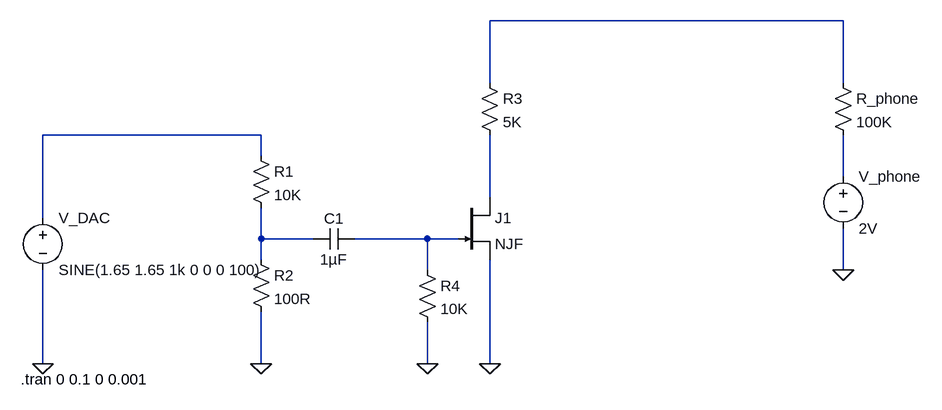
[diagram p0: schematic Mic_interface.asc]
Mic_interface.asc, the LTspice schematic file:
Version 4
SHEET 1 1432 680
WIRE 1280 -304 736 -304
WIRE 736 -208 736 -304
WIRE 1280 -208 1280 -304
WIRE 384 -128 48 -128
WIRE 384 -96 384 -128
WIRE 1280 -64 1280 -128
WIRE 736 -32 736 -128
WIRE 48 0 48 -128
WIRE 384 32 384 -16
WIRE 464 32 384 32
WIRE 640 32 528 32
WIRE 688 32 640 32
WIRE 384 64 384 32
WIRE 640 80 640 32
WIRE 1280 80 1280 16
WIRE 48 224 48 80
WIRE 384 224 384 144
WIRE 640 224 640 160
WIRE 736 224 736 64
FLAG 48 224 0
FLAG 384 224 0
FLAG 640 224 0
FLAG 1280 80 0
FLAG 736 224 0
SYMBOL voltage 48 -16 R0
WINDOW 123 0 0 Left 0
WINDOW 39 0 0 Left 0
SYMATTR InstName V_DAC
SYMATTR Value SINE(1.65 1.65 1k 0 0 0 100)
SYMBOL res 368 -112 R0
SYMATTR InstName R1
SYMATTR Value 10K
SYMBOL res 368 48 R0
SYMATTR InstName R2
SYMATTR Value 100R
SYMBOL res 720 -224 R0
SYMATTR InstName R3
SYMATTR Value 5K
SYMBOL res 624 64 R0
SYMATTR InstName R4
SYMATTR Value 10K
SYMBOL res 1264 -224 R0
SYMATTR InstName R_phone
SYMATTR Value 100K
SYMBOL cap 528 16 R90
WINDOW 0 0 32 VBottom 2
WINDOW 3 32 32 VTop 2
SYMATTR InstName C1
SYMATTR Value 1µF
SYMBOL njf 688 -32 R0
SYMATTR InstName J1
SYMBOL voltage 1280 -80 R0
SYMATTR InstName V_phone
SYMATTR Value 2V
TEXT 14 248 Left 2 !.tran 0 0.1 0 0.001

The netlist it stands for:
* Mic_interface.asc
V_DAC N002 0 SINE(1.65 1.65 1k 0 0 0 100)
R1 N002 N005 10K
R2 N005 0 100R
R3 N001 N004 5K
R4 N006 0 10K
R_phone N001 N003 100K
C1 N006 N005 1µF
J1 N004 N006 0 NJF
V_phone N003 0 2V
.model NJF NJF
.model PJF PJF
.lib standard.jft
.tran 0 0.1 0 0.001
.backanno
.end